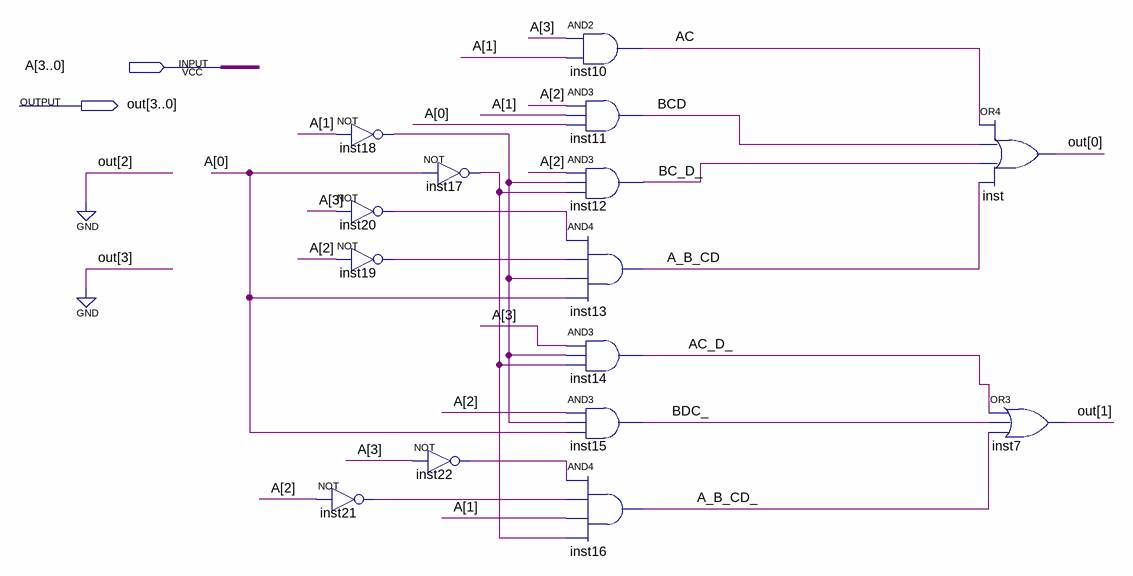
[diagram p0: schematic sheet]
// Quartus schematic 4BitRemainder.bdf as structural Verilog: 15 symbols, 2 pins
module \4BitRemainder  (
  input  [3:0] A,
  output [3:0] out
);

  wire A_B_CD, A_B_CD_, AC, AC_D_, BC_D_, BCD, BDC_, inst17_out, inst18_out, inst19_out, inst20_out,
       inst21_out, inst22_out;

  not inst18 (inst18_out, A[1]);
  not inst20 (inst20_out, A[3]);
  not inst19 (inst19_out, A[2]);
  not inst21 (inst21_out, A[2]);
  not inst22 (inst22_out, A[3]);
  not inst17 (inst17_out, A[0]);
  and inst10 (AC, A[3], A[1]);
  and inst11 (BCD, A[2], A[1], A[0]);
  and inst12 (BC_D_, A[2], inst18_out, inst17_out);
  and inst13 (A_B_CD, inst20_out, inst19_out, inst18_out, A[0]);
  and inst14 (AC_D_, A[3], inst18_out, inst17_out);
  and inst15 (BDC_, A[2], inst18_out, A[0]);
  and inst16 (A_B_CD_, inst22_out, inst21_out, A[1], inst17_out);
  or inst (out[0], AC, BCD, BC_D_, A_B_CD);
  or inst7 (out[1], AC_D_, BDC_, A_B_CD_);

  assign out[3:2] = 2'b00;
endmodule
